# Altium schematic sheet FPGA_Ground.SchDoc: FPGA Ground
size A portrait; Organization: UCLA High Energy Physics; DocumentNumber: 11; Revision: 1.0; SheetNumber: 11; SheetTotal: 12; CurrentDate: 8/7/2018; ModifiedDate: 2/7/2018
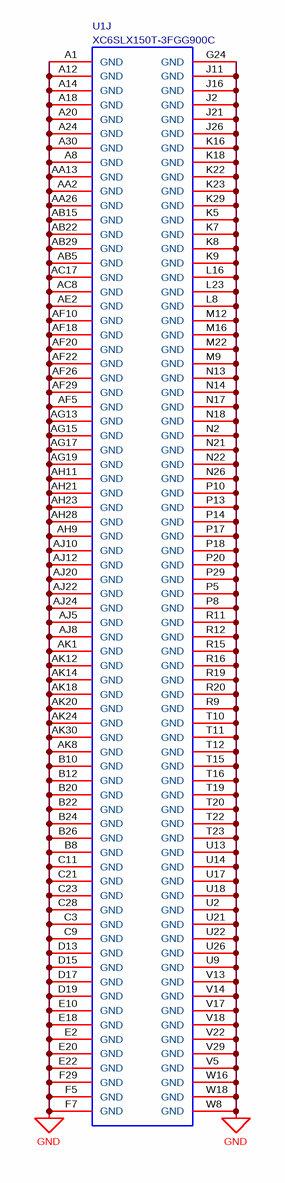
[diagram p0: FPGA_Ground.SchDoc]

## Parts
U1  XC6SLX150T-3FGG900C  [MC_S6/BGA/FGG900]  (part J of 13)

## Nets
GND: U1.A1(GND) U1.A8(GND) U1.A12(GND) U1.A14(GND) U1.A18(GND) U1.A20(GND) U1.A24(GND) U1.A30(GND) U1.AA2(GND) U1.AA13(GND) U1.AA26(GND) U1.AB5(GND) U1.AB15(GND) U1.AB22(GND) U1.AB29(GND) U1.AC8(GND) U1.AC17(GND) U1.AE2(GND) U1.AF5(GND) U1.AF10(GND) U1.AF18(GND) U1.AF20(GND) U1.AF22(GND) U1.AF26(GND) U1.AF29(GND) U1.AG13(GND) U1.AG15(GND) U1.AG17(GND) U1.AG19(GND) U1.AH9(GND) U1.AH11(GND) U1.AH21(GND) U1.AH23(GND) U1.AH28(GND) U1.AJ5(GND) U1.AJ8(GND) U1.AJ10(GND) U1.AJ12(GND) U1.AJ20(GND) U1.AJ22(GND) U1.AJ24(GND) U1.AK1(GND) U1.AK8(GND) U1.AK12(GND) U1.AK14(GND) U1.AK18(GND) U1.AK20(GND) U1.AK24(GND) U1.AK30(GND) U1.B8(GND) U1.B10(GND) U1.B12(GND) U1.B20(GND) U1.B22(GND) U1.B24(GND) U1.B26(GND) U1.C3(GND) U1.C9(GND) U1.C11(GND) U1.C21(GND) U1.C23(GND) U1.C28(GND) U1.D13(GND) U1.D15(GND) U1.D17(GND) U1.D19(GND) U1.E2(GND) U1.E10(GND) U1.E18(GND) U1.E20(GND) U1.E22(GND) U1.F5(GND) U1.F7(GND) U1.F29(GND) U1.G24(GND) U1.J2(GND) U1.J11(GND) U1.J16(GND) U1.J21(GND) U1.J26(GND) U1.K5(GND) U1.K7(GND) U1.K8(GND) U1.K9(GND) U1.K16(GND) U1.K18(GND) U1.K22(GND) U1.K23(GND) U1.K29(GND) U1.L8(GND) U1.L16(GND) U1.L23(GND) U1.M9(GND) U1.M12(GND) U1.M16(GND) U1.M22(GND) U1.N2(GND) U1.N13(GND) U1.N14(GND) U1.N17(GND) U1.N18(GND) U1.N21(GND) U1.N22(GND) U1.N26(GND) U1.P5(GND) U1.P8(GND) U1.P10(GND) U1.P13(GND) U1.P14(GND) U1.P17(GND) U1.P18(GND) U1.P20(GND) U1.P29(GND) U1.R9(GND) U1.R11(GND) U1.R12(GND) U1.R15(GND) U1.R16(GND) U1.R19(GND) U1.R20(GND) U1.T10(GND) U1.T11(GND) U1.T12(GND) U1.T15(GND) U1.T16(GND) U1.T19(GND) U1.T20(GND) U1.T22(GND) U1.T23(GND) U1.U2(GND) U1.U9(GND) U1.U13(GND) U1.U14(GND) U1.U17(GND) U1.U18(GND) U1.U21(GND) U1.U22(GND) U1.U26(GND) U1.V5(GND) U1.V13(GND) U1.V14(GND) U1.V17(GND) U1.V18(GND) U1.V22(GND) U1.V29(GND) U1.W8(GND) U1.W16(GND) U1.W18(GND)

## Notes on the sheet
- Date:
- Rev:
- of
- Sheet

## Library data of the parts
U1 = XC6SLX150T-3FGG900C: Spartan-6 LXT 1.2V FPGA, 540 User I/Os, 900-Ball Chip-Scale BGA (1.0mm Pitch), Speed Grade 3, Commercial Grade, Pb-Free; Manufacturer: Xilinx Inc.; Number of I/O: 540; Voltage - Supply: 1.14 V ~ 1.26 V; DatasheetVersion: ver1.6, Nov-2010; PackageVersion: ver1.4, Nov-2009; PackageReference: FGG900; PackageDescription: 900-Ball Fine-Pitch Ball Grid Array (FGG900) - Pb-Free; Code_JEDEC: MS-034-AAN-1; Code_IPC: BGA100P30X30-900; ComponentLink1Description: Manufacturer URL; ComponentLink1URL: http://www.xilinx.com/; ComponentLink2Description: Spartan-6 Datasheet; ComponentLink2URL: http://www.xilinx.com/support/documentation/data_sheets/ds160.pdf; ComponentLink3Description: Spartan-6 Documents; ComponentLink3URL: http://www.xilinx.com/support/documentation/spartan-6.htm; Supplier 1: Digi-Key; Manufacturer Part Number: XC6SLX150T-3FGG900C; RoHS: RoHS Compliant; Category: Integrated Circuits (ICs); Stock 1: 0; Pricing 1: 27=287.3 (USD); Part Status: Active; Mounting Type: Surface Mount; Operating Temperature: 0°C ~ 85°C (TJ); Package / Case: 900-BBGA; Supplier Device Package: 900-FBGA (31x31); ComponentLink4URL: http://www.xilinx.com/support/documentation/data_sheets/ds162.pdf; ComponentLink4Description: http://www.xilinx.com/support/documentation/data_sheets/ds162.pdf; Supplier Part Number 1: XC6SLX150T-3FGG900C-ND